# Altium project pca10056.PrjPCB (part 1 of 5)
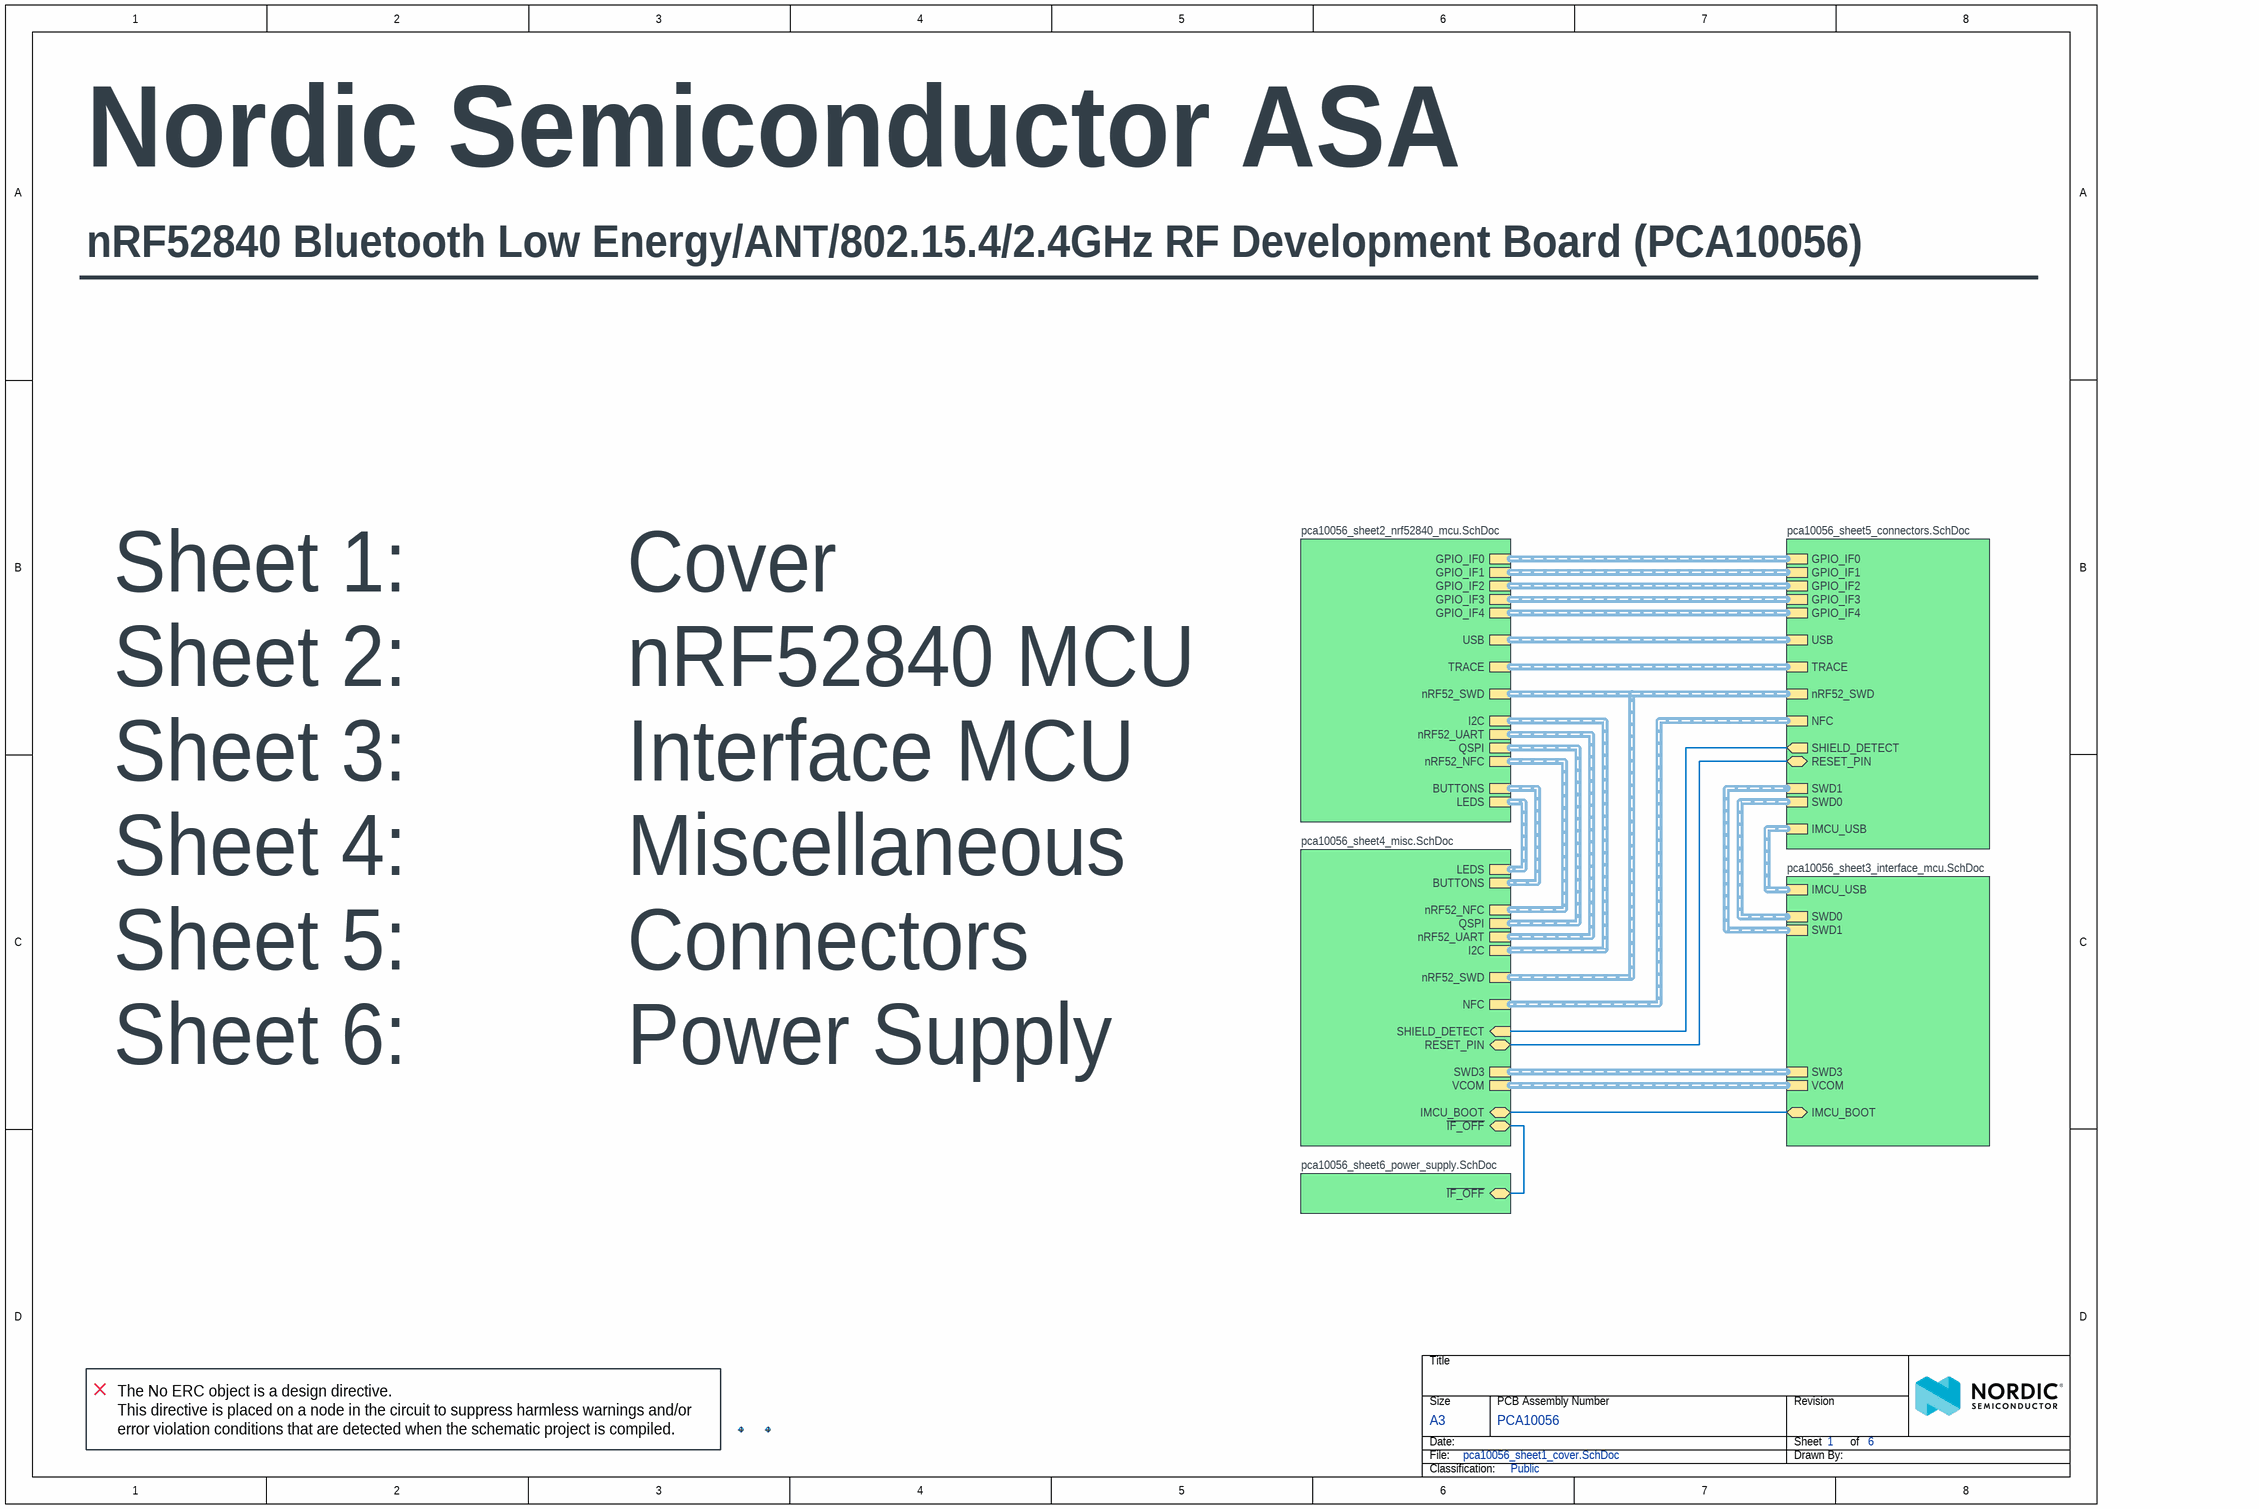
[diagram p0: pca10056_sheet1_cover.SchDoc]
SurfaceFinish: ENIG; SoldermaskColor: Blue; SilkscreenColor: White; ProjectNumber: 4440; ProjectName: nRF52840-DK; ProductName: nRF52840-DK; PCBStackup: 4001: Standard 1.6mm 1oz; PCBRevision: 0461RUBR; PCBNumber: 400236; PCARevision: 3.0.3; PCAName: PCA10056; Organization: Nordic Semiconductor; NrOfLayers: 4; Dielectric: FR-4 Halogen-Free; Designer: MASI/RUBR/STL1/RSK; Compliance: RoHS, REACH, Halogen-Free; Classification: Public; BoardTitle: nRF52840 Development Board; BoardThickness: 1.6mm
6 sheets, 344 parts. Net scope: hierarchical (ports join the sheet entries above them; power ports are global).
Board file: 400236.PcbDoc
Sheets:
  pca10056_sheet1_cover.SchDoc
     = pca10056_sheet2_nrf52840_mcu.SchDoc
     = pca10056_sheet3_interface_mcu.SchDoc
     = pca10056_sheet4_misc.SchDoc
     = pca10056_sheet5_connectors.SchDoc
     = pca10056_sheet6_power_supply.SchDoc

## Sheet pca10056_sheet1_cover.SchDoc: =BoardTitle + ' - Cover'
size A3; Organization: Nordic Semiconductor; DocumentNumber: 1; Revision: 3.0.3; SheetNumber: 1; SheetTotal: 6; Author: MASI/RUBR/STL1/RSK; CompanyName: Nordic Semiconductor; DrawnBy: MASI/RUBR/STL1/RSK; DocumentSize: A3; ProjectName: nRF52840-DK

### Parts
Fid1  Fiducial mark  [Fiducial]  (value not drawn)
Fid2  Fiducial mark  [Fiducial]  (value not drawn)

### Sub-sheets
? = pca10056_sheet2_nrf52840_mcu.SchDoc: nRF52_SWD (harness SWD), BUTTONS (harness BUTTONS), GPIO_IF2 (harness GPIO_IF2), GPIO_IF4 (harness GPIO_IF4), I2C (harness I2C), nRF52_UART (harness nRF52_UART), GPIO_IF1 (harness GPIO_IF1), GPIO_IF0 (harness GPIO_IF0), QSPI (harness QSPI), TRACE (harness TRACE), nRF52_NFC (harness NFC), LEDS (harness LED), USB (harness USB), GPIO_IF3 (harness GPIO_IF3)
? = pca10056_sheet3_interface_mcu.SchDoc: SWD0 (harness SWD), IMCU_BOOT (bidir), SWD3 (harness SWD), SWD1 (harness SWD), VCOM (harness UART), IMCU_USB (harness USB)
? = pca10056_sheet4_misc.SchDoc: NFC (harness NFC), QSPI (harness QSPI), SHIELD_DETECT (in), LEDS (harness LED), SWD3 (harness SWD), nRF52_UART (harness nRF52_UART), ~{IF_OFF} (bidir), nRF52_NFC (harness NFC), I2C (harness I2C), BUTTONS (harness BUTTONS), IMCU_BOOT (bidir), RESET_PIN (bidir), nRF52_SWD (harness SWD), VCOM (harness UART)
? = pca10056_sheet5_connectors.SchDoc: SWD0 (harness SWD), SHIELD_DETECT (out), SWD1 (harness SWD), RESET_PIN (bidir), GPIO_IF2 (harness GPIO_IF2), USB (harness USB), GPIO_IF4 (harness GPIO_IF4), nRF52_SWD (harness SWD), GPIO_IF3 (harness GPIO_IF3), TRACE (harness TRACE), GPIO_IF1 (harness GPIO_IF1), GPIO_IF0 (harness GPIO_IF0), IMCU_USB (harness USB), NFC (harness NFC)
? = pca10056_sheet6_power_supply.SchDoc: ~{IF_OFF} (bidir)

### Nets
~{IF_OFF}: sheet /~{IF_OFF}, sheet /~{IF_OFF}
IMCU_BOOT: sheet /IMCU_BOOT, sheet /IMCU_BOOT
RESET_PIN: sheet /RESET_PIN, sheet /RESET_PIN
NetR68_1: sheet /SHIELD_DETECT, sheet /SHIELD_DETECT

### Notes on the sheet
- Nordic Semiconductor ASA
- ________________________________________________________________
- nRF52840 Bluetooth Low Energy/ANT/802.15.4/2.4GHz RF Development Board (PCA10056)
- Sheet 1:          Cover
- Sheet 2:          nRF52840 MCU
- Sheet 3:          Interface MCU
- Sheet 4:          Miscellaneous
- Sheet 5:          Connectors
- Sheet 6:          Power Supply
- (near Fid1) The No ERC object is a design directive.
  This directive is placed on a node in the circuit to suppress harmless warnings and/or error violation conditions that are detected when the schematic project is compiled.
- Title
- Size
- Date:
- File:
- A3
- PCB Assembly Number
- Sheet         of
- Drawn By:
- Revision
- Classification:

### Library data of the parts
Fid1 Fid2 = Fid-Mark: Manufacturer: N.A.; Part number NEMS: 100500073; Value: N.A.; Pad Count: 1; Component Status: Active; System: Connector; Part Number: Fid-Mark; Manufacturer Part Number: N.A.; LatestRevisionDate: 2009-12-12; Published: 2009-12-12; Note: N.A.; Artikkelnr Noca: N.A.; Footprint Doc: Fiducial; Part number IPS: N.A.; ComponentLink1URL: N.A.; ComponentLink1Description: Datasheet; ComponentLink2URL: N.A.; ComponentLink2Description: Supplier link; HelpURL: N.A.; Supplier 1: N.A.; Supplier Part Number 1: N.A.; Supplier 2: N.A.; Supplier Part Number 2: N.A.; Author: rsk; Component Class: Connectors; PartId: 100500073; Part number Norautron: N.A.

## Sheet pca10056_sheet2_nrf52840_mcu.SchDoc: =BoardTitle + ' - nRF52840 MCU'
size A3; Organization: Nordic Semiconductor; DocumentNumber: 2; Revision: 3.0.3; SheetNumber: 2; SheetTotal: 6; Author: MASI/RUBR/STL1/RSK; CompanyName: Nordic Semiconductor; DrawnBy: MASI/RUBR/STL1/RSK; DocumentSize: A3; ProjectName: nRF52840-DK
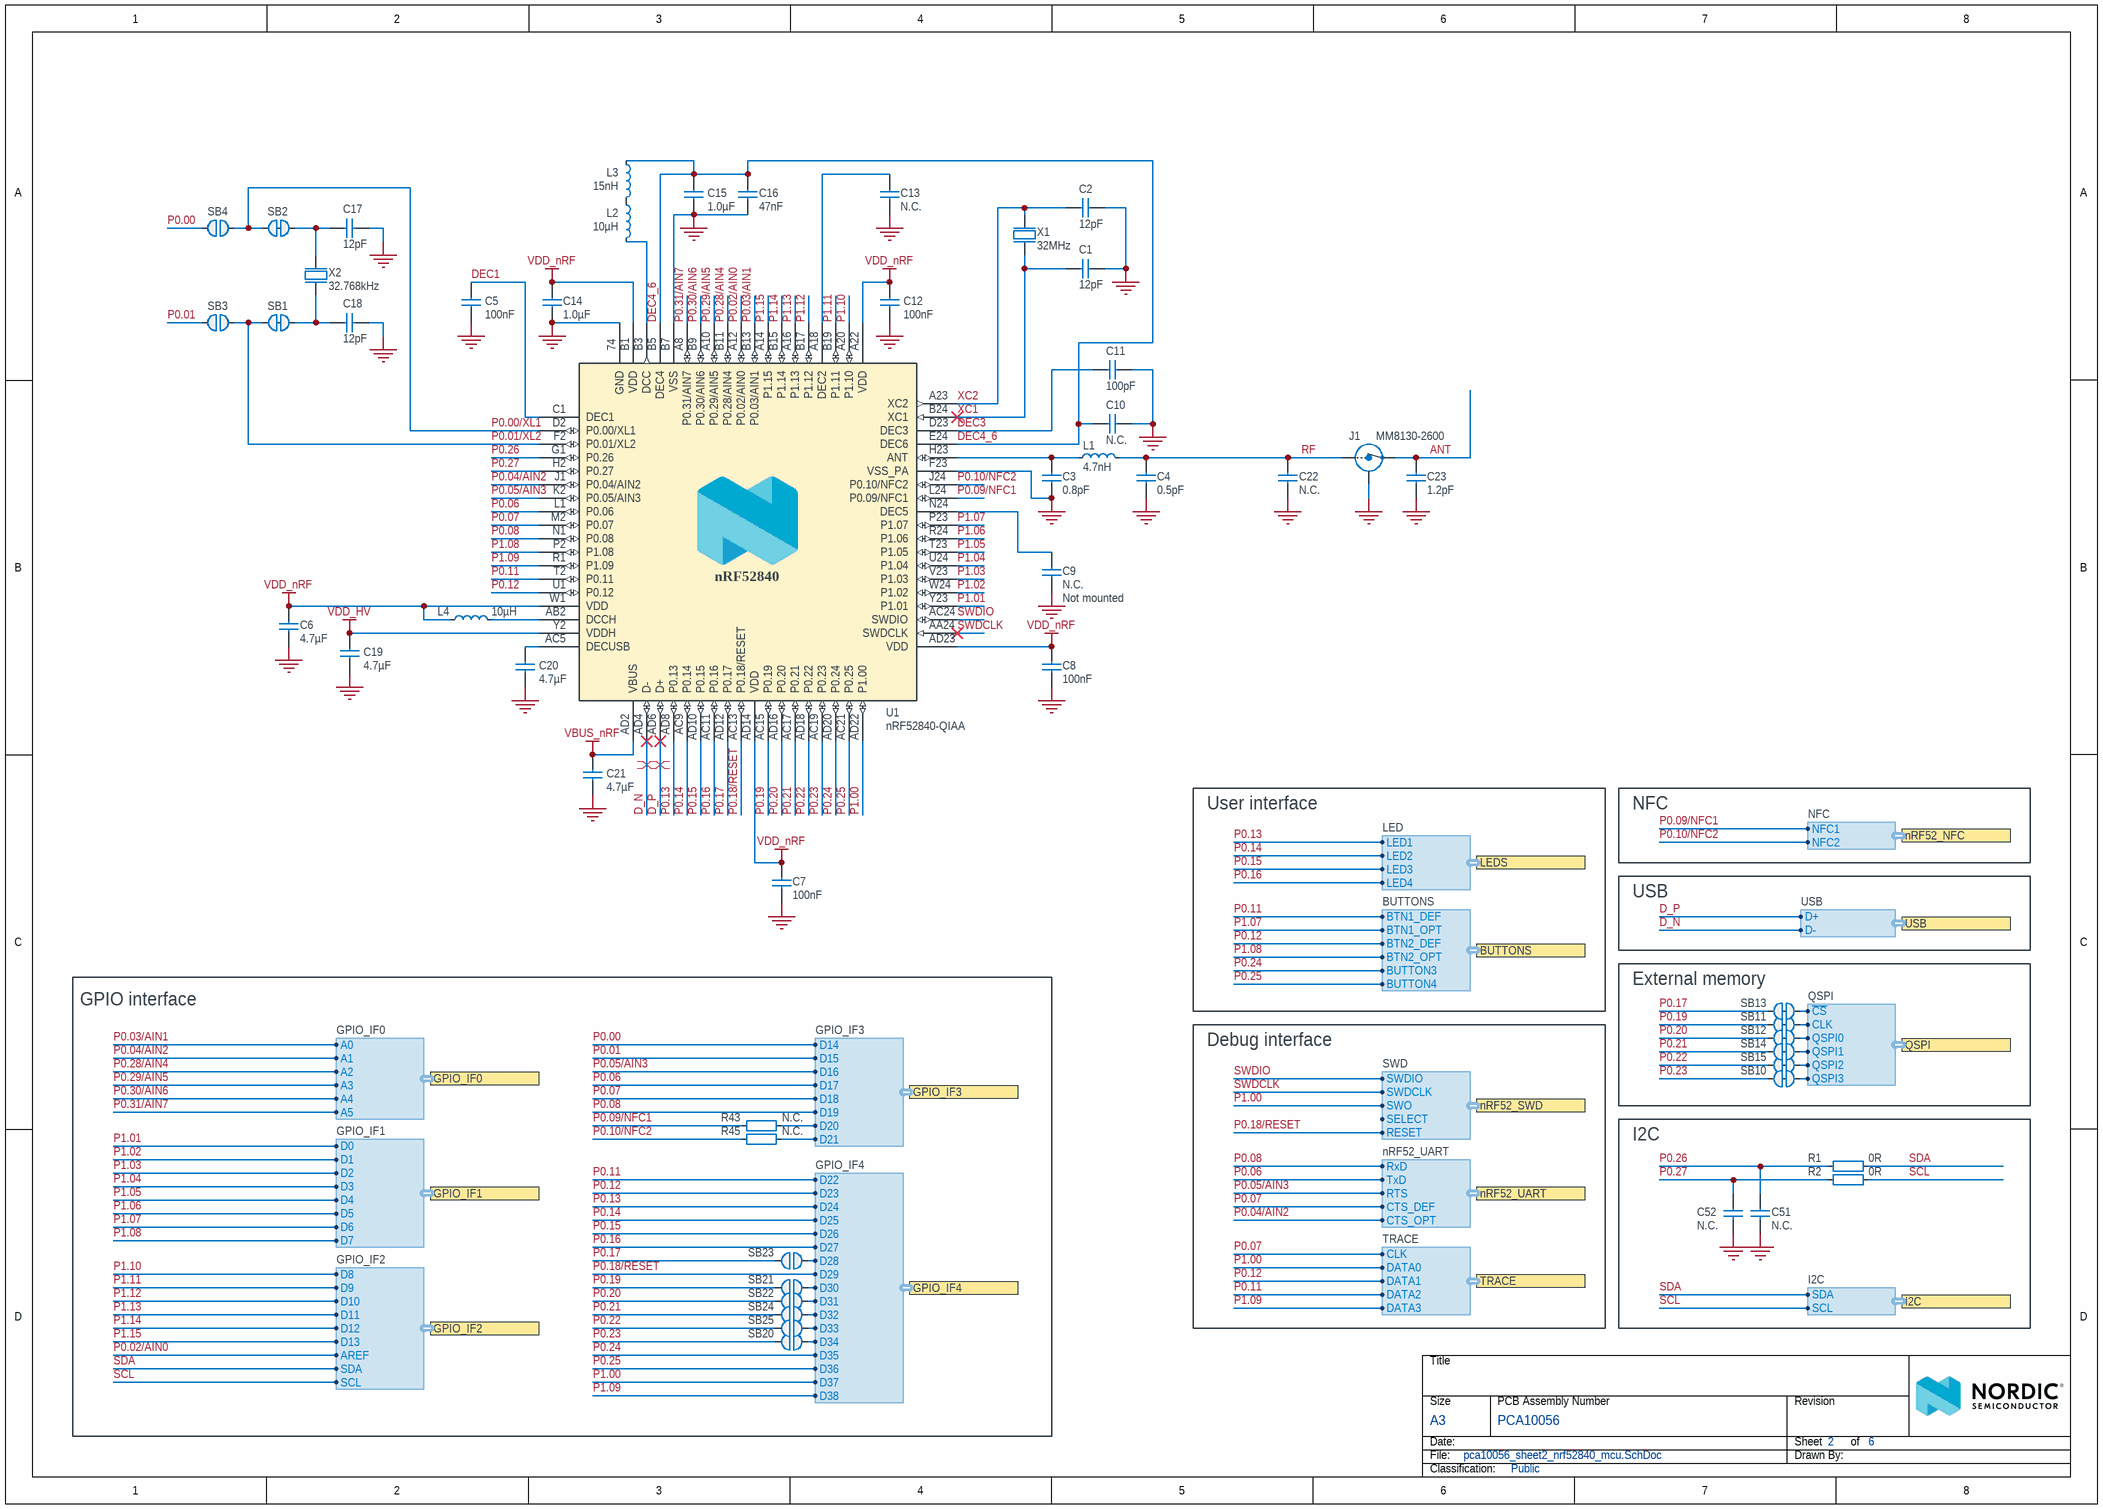
[diagram p1: pca10056_sheet2_nrf52840_mcu.SchDoc]

### Parts
C1  12pF  [CAPC1005X04L]
C2  12pF  [CAPC1005X04L]
C3  0.8pF  [CAPC1005X04L]
C4  0.5pF  [CAPC1005X04L]
C5  100nF  [CAPC1005X04L]
C6  4.7µF  [CAPC1608X06L]
C7  100nF  [CAPC1005X04L]
C8  100nF  [CAPC1005X04L]
C9  N.C.  Assembly: Not mounted  [CAPC1005X04L_NC]
C10  N.C.  [CAPC1005X04L_NC]
C11  100pF  [CAPC1005X04L]
C12  100nF  [CAPC1005X04L]
C13  N.C.  [CAPC1005X04L_NC]
C14  1.0µF  [CAPC1608X06L]
C15  1.0µF  [CAPC1608X06L]
C16  47nF  [CAPC1005X04L]
C17  12pF  [CAPC1005X04L]
C18  12pF  [CAPC1005X04L]
C19  4.7µF  [CAPC1608X06L]
C20  4.7µF  [CAPC1608X06L]
C21  4.7µF  [CAPC1608X06L]
C22  N.C.  [CAPC1005X04L_NC]
C23  1.2pF  [CAPC1005X04L]
C51  N.C.  [CAPC0603X03L_C_NC]
C52  N.C.  [CAPC0603X03L_C_NC]
J1  MM8130-2600  [COAXIAL-SWF]
L1  4.7nH  [INDC1005X04L]
L2  10µH  [INDC1608X06L]
L3  15nH  [INDC1005X04L]
L4  10µH  [INDC1608X06L]
R1  0R  [RESC0603X03L_C]
R2  0R  [RESC0603X03L_C]
R43  N.C.  [RESC1005X04L_NC]
R45  N.C.  [RESC1005X04L_NC]
SB1  Solderbridge  [Solderbridge_Shorted]  (value not drawn)  (net tie, no BOM)
SB2  Solderbridge  [Solderbridge_Shorted]  (value not drawn)  (net tie, no BOM)
SB3  Solderbridge  [Solderbridge]  (value not drawn)  (no BOM)
SB4  Solderbridge  [Solderbridge]  (value not drawn)  (no BOM)
SB10  Solderbridge  [Solderbridge_Shorted]  (value not drawn)  (net tie, no BOM)
SB11  Solderbridge  [Solderbridge_Shorted]  (value not drawn)  (net tie, no BOM)
SB12  Solderbridge  [Solderbridge_Shorted]  (value not drawn)  (net tie, no BOM)
SB13  Solderbridge  [Solderbridge_Shorted]  (value not drawn)  (net tie, no BOM)
SB14  Solderbridge  [Solderbridge_Shorted]  (value not drawn)  (net tie, no BOM)
SB15  Solderbridge  [Solderbridge_Shorted]  (value not drawn)  (net tie, no BOM)
SB20  Solderbridge  [Solderbridge]  (value not drawn)  (no BOM)
SB21  Solderbridge  [Solderbridge]  (value not drawn)  (no BOM)
SB22  Solderbridge  [Solderbridge]  (value not drawn)  (no BOM)
SB23  Solderbridge  [Solderbridge]  (value not drawn)  (no BOM)
SB24  Solderbridge  [Solderbridge]  (value not drawn)  (no BOM)
SB25  Solderbridge  [Solderbridge]  (value not drawn)  (no BOM)
U1  nRF52840-QIAA  [AQFN50P700X700X85_HS-74N]
X1  32MHz  [BT-XTAL_2016]
X2  32.768kHz  [XTAL_3215]

### Blocks framed on the sheet
GPIO interface: R43 R45 SB20-SB25
External memory: SB10-SB15
I2C: C51 C52 R1 R2

### Ports
BUTTONS (harness BUTTONS), GPIO_IF0 (harness GPIO_IF0), GPIO_IF1 (harness GPIO_IF1), GPIO_IF2 (harness GPIO_IF2), GPIO_IF3 (harness GPIO_IF3), GPIO_IF4 (harness GPIO_IF4), I2C (harness I2C), LEDS (harness LED), nRF52_NFC (harness NFC), nRF52_SWD (harness SWD), nRF52_UART (harness nRF52_UART), QSPI (harness QSPI), TRACE (harness TRACE), USB (harness USB)

### Harnesses
BUTTONS: BTN2_OPT, BTN2_DEF, BTN1_OPT, BTN1_DEF, BUTTON3, BUTTON4
QSPI: ~{CS}, QSPI0, CLK, QSPI1, QSPI2, QSPI3
SWD: SWDIO, SWDCLK, SWO, RESET, SELECT
LED: LED4, LED3, LED2, LED1
USB: D+, D-
TRACE: CLK, DATA0, DATA1, DATA3, DATA2
NFC: NFC2, NFC1
GPIO_IF1: D0, D1, D2, D3, D4, D5, D6, D7
GPIO_IF2: D8, D9, D10, D11, D12, D13, AREF, SDA, SCL
GPIO_IF0: A0, A1, A2, A3, A4, A5
GPIO_IF3: D14, D15, D16, D17, D18, D19, D20, D21
I2C: SCL, SDA
GPIO_IF4: D22, D23, D24, D25, D26, D27, D28, D29, D30, D31, D32, D33, D34, D35, D36, D37, D38
nRF52_UART: RTS, CTS_DEF, CTS_OPT, TxD, RxD

### Nets
GND: C1.2 C2.2 C3.1 C4.1 C5.2 C6.2 C7.2 C8.2 C9.2 C10.1 C11.2 C12.2 C13.2 C14.2 C15.1 C16.2 C17.1 C18.1 C19.2 C20.2 C21.2 C22.2 C23.2 C51.1 C52.1 J1.2(Shield) U1.74(GND) U1.B7(VSS) U1.F23(VSS_PA) X1.2(GND) X1.4(GND)
VBUS_nRF: C21.1 U1.AD2(VBUS)
VDD_HV: C19.1 U1.Y2(VDDH)
VDD_nRF: C6.1 C7.1 C8.1 C12.1 C14.1 L4.1 U1.A22(VDD) U1.AD14(VDD) U1.AD23(VDD) U1.B1(VDD) U1.W1(VDD)
ANT: C23.1 J1.3(OUT)
D_N: U1.AD4(D-) ; port USB.D-
D_P: U1.AD6(D+) ; port USB.D+
DEC1: C5.1 U1.C1(DEC1)
DEC3: C11.1 U1.D23(DEC3)
DEC4_6: C10.2 C15.2 C16.1 L3.1 U1.B5(DEC4) U1.E24(DEC6)
P0.00: SB4.2 ; port GPIO_IF3.D14
P0.00/XL1: SB2.2 SB4.1 U1.D2(P0.00/XL1)
P0.01: SB3.2 ; port GPIO_IF3.D15
P0.01/XL2: SB1.2 SB3.1 U1.F2(P0.01/XL2)
P0.02/AIN0: U1.A12(P0.02/AIN0) ; port GPIO_IF2.AREF
P0.03/AIN1: U1.B13(P0.03/AIN1) ; port GPIO_IF0.A0
P0.04/AIN2: U1.J1(P0.04/AIN2) ; port GPIO_IF0.A1, port nRF52_UART.CTS_OPT
P0.05/AIN3: U1.K2(P0.05/AIN3) ; port GPIO_IF3.D16, port nRF52_UART.RTS
P0.06: U1.L1(P0.06) ; port GPIO_IF3.D17, port nRF52_UART.TxD
P0.07: U1.M2(P0.07) ; port TRACE.CLK, port GPIO_IF3.D18, port nRF52_UART.CTS_DEF
P0.08: U1.N1(P0.08) ; port GPIO_IF3.D19, port nRF52_UART.RxD
P0.09/NFC1: R43.2 U1.L24(P0.09/NFC1) ; port nRF52_NFC.NFC1
P0.10/NFC2: R45.2 U1.J24(P0.10/NFC2) ; port nRF52_NFC.NFC2
P0.11: U1.T2(P0.11) ; port BUTTONS.BTN1_DEF, port TRACE.DATA2, port GPIO_IF4.D22
P0.12: U1.U1(P0.12) ; port BUTTONS.BTN2_DEF, port TRACE.DATA1, port GPIO_IF4.D23
P0.13: U1.AD8(P0.13) ; port LEDS.LED1, port GPIO_IF4.D24
P0.14: U1.AC9(P0.14) ; port LEDS.LED2, port GPIO_IF4.D25
P0.15: U1.AD10(P0.15) ; port LEDS.LED3, port GPIO_IF4.D26
P0.16: U1.AC11(P0.16) ; port LEDS.LED4, port GPIO_IF4.D27
P0.17: SB13.1 SB23.1 U1.AD12(P0.17)
P0.18/RESET: U1.AC13(P0.18/RESET) ; port nRF52_SWD.RESET, port GPIO_IF4.D29
P0.19: SB11.1 SB21.1 U1.AC15(P0.19)
P0.20: SB12.1 SB22.1 U1.AD16(P0.20)
P0.21: SB14.1 SB24.1 U1.AC17(P0.21)
P0.22: SB15.1 SB25.1 U1.AD18(P0.22)
P0.23: SB10.1 SB20.1 U1.AC19(P0.23)
P0.24: U1.AD20(P0.24) ; port BUTTONS.BUTTON3, port GPIO_IF4.D35
P0.25: U1.AC21(P0.25) ; port BUTTONS.BUTTON4, port GPIO_IF4.D36
P0.26: C51.2 R1.2 U1.G1(P0.26)
P0.27: C52.2 R2.2 U1.H2(P0.27)
P0.28/AIN4: U1.B11(P0.28/AIN4) ; port GPIO_IF0.A2
P0.29/AIN5: U1.A10(P0.29/AIN5) ; port GPIO_IF0.A3
P0.30/AIN6: U1.B9(P0.30/AIN6) ; port GPIO_IF0.A4
P0.31/AIN7: U1.A8(P0.31/AIN7) ; port GPIO_IF0.A5
P1.00: U1.AD22(P1.00) ; port nRF52_SWD.SWO, port TRACE.DATA0, port GPIO_IF4.D37
P1.01: U1.Y23(P1.01) ; port GPIO_IF1.D0
P1.02: U1.W24(P1.02) ; port GPIO_IF1.D1
P1.03: U1.V23(P1.03) ; port GPIO_IF1.D2
P1.04: U1.U24(P1.04) ; port GPIO_IF1.D3
P1.05: U1.T23(P1.05) ; port GPIO_IF1.D4
P1.06: U1.R24(P1.06) ; port GPIO_IF1.D5
P1.07: U1.P23(P1.07) ; port BUTTONS.BTN1_OPT, port GPIO_IF1.D6
P1.08: U1.P2(P1.08) ; port BUTTONS.BTN2_OPT, port GPIO_IF1.D7
P1.09: U1.R1(P1.09) ; port TRACE.DATA3, port GPIO_IF4.D38
P1.10: U1.A20(P1.10) ; port GPIO_IF2.D8
P1.11: U1.B19(P1.11) ; port GPIO_IF2.D9
P1.12: U1.B17(P1.12) ; port GPIO_IF2.D10
P1.13: U1.A16(P1.13) ; port GPIO_IF2.D11
P1.14: U1.B15(P1.14) ; port GPIO_IF2.D12
P1.15: U1.A14(P1.15) ; port GPIO_IF2.D13
RF: C4.2 C22.1 J1.1(IN) L1.2
SCL: R2.1 ; port GPIO_IF2.SCL, port I2C.SCL
SDA: R1.1 ; port GPIO_IF2.SDA, port I2C.SDA
SWDCLK: U1.AA24(SWDCLK) ; port nRF52_SWD.SWDCLK
SWDIO: U1.AC24(SWDIO) ; port nRF52_SWD.SWDIO
XC1: C1.1 U1.B24(XC1) X1.1(inp)
XC2: C2.1 U1.A23(XC2) X1.3(out)
NetC3_2: C3.2 L1.1 U1.H23(ANT)
NetC9_1: C9.1 U1.N24(DEC5)
NetC13_1: C13.1 U1.A18(DEC2)
NetC17_2: C17.2 SB2.1 X2.1(inp)
NetC18_2: C18.2 SB1.1 X2.2(out)
NetC20_1: C20.1 U1.AC5(DECUSB)
NetL2_1: L2.1 L3.2
NetL2_2: L2.2 U1.B3(DCC)
NetL4_2: L4.2 U1.AB2(DCCH)
NetP6_7: R43.1 ; port GPIO_IF3.D20
NetP6_8: R45.1 ; port GPIO_IF3.D21
NetP24_7: SB23.2 ; port GPIO_IF4.D28
NetP24_9: SB21.2 ; port GPIO_IF4.D30
NetP24_10: SB22.2 ; port GPIO_IF4.D31
NetP24_11: SB24.2 ; port GPIO_IF4.D32
NetP24_12: SB25.2 ; port GPIO_IF4.D33
NetP24_13: SB20.2 ; port GPIO_IF4.D34
NetSB10_2: SB10.2 ; port QSPI.QSPI3
NetSB11_2: SB11.2 ; port QSPI.CLK
NetSB12_2: SB12.2 ; port QSPI.QSPI0
NetSB13_2: SB13.2 ; port QSPI.~{CS}
NetSB14_2: SB14.2 ; port QSPI.QSPI1
NetSB15_2: SB15.2 ; port QSPI.QSPI2

### Layout directives
differential pair: D_N, D_P

### Notes on the sheet
- User interface
- NFC
- USB
- Debug interface
- Title
- Size
- Date:
- File:
- A3
- PCB Assembly Number
- Sheet         of
- Drawn By:
- Revision
- Classification:
- (in symbol nRF52840-QIAAF0) nRF52840

### Library data of the parts
C1 C2 C17 C18 = C0402-12p: Capacitor, NP0, ±2%; Manufacturer: N.A.; Part number IPS: 00000002398; Part number NEMS: 100200137; Note: 50V; Artikkelnr Noca: 20029159; Pad Count: 2; Component Status: Active; Part Number: C0402-12p; LatestRevisionDate: 2011-05-11; Published: 2009-05-08; Value: 12pF; Footprint Doc: 0402; Manufacturer Part Number: N.A.; ComponentLink1URL: N.A.; ComponentLink1Description: Datasheet; ComponentLink2URL: N.A.; ComponentLink2Description: Supplier link; HelpURL: N.A.; Supplier 1: N.A.; Supplier Part Number 1: N.A.; Supplier 2: N.A.; Supplier Part Number 2: N.A.; Author: rsk; Component Class: Capacitors; PartId: 100200137; Part number Norautron: N.A.
C3 = C0402-0.8p: Capacitor, NP0, ±5%; Manufacturer: N.A.; Part number IPS: 00000007782; Part number NEMS: 100200116; Note: 50V; Pad Count: 2; Component Status: Active; Part Number: C0402-0.8p; LatestRevisionDate: 2012-11-21; Published: 2009-05-08; Value: 0.8pF; Footprint Doc: 0402; Manufacturer Part Number: N.A.; Artikkelnr Noca: N.A.; ComponentLink1URL: https://www.murata.com/~/media/webrenewal/support/library/catalog/products/capacitor/mlcc/c02e.ashx?la=en-us; ComponentLink1Description: Datasheet; ComponentLink2URL: N.A.; ComponentLink2Description: Supplier link; HelpURL: N.A.; Supplier 1: N.A.; Supplier Part Number 1: N.A.; Supplier 2: N.A.; Supplier Part Number 2: N.A.; Author: rsk; Component Class: Capacitors; PartId: 100200116; Part number Norautron: N.A.
C4 = C0402-0.5p: Capacitor, C0G, ±0.05pF, 50V; Manufacturer: N.A.; Part number IPS: 00000004293; Part number NEMS: 100200112; Pad Count: 2; Component Status: Active; Part Number: C0402-0.5p; LatestRevisionDate: 2020-10-13; Published: 2009-05-08; Value: 0.5pF; Note: 50V; Footprint Doc: 0402; Manufacturer Part Number: N.A.; Artikkelnr Noca: N.A.; ComponentLink1URL: N.A.; ComponentLink1Description: Datasheet; ComponentLink2URL: N.A.; ComponentLink2Description: Supplier link; HelpURL: N.A.; Supplier 1: N.A.; Supplier Part Number 1: N.A.; Supplier 2: N.A.; Supplier Part Number 2: N.A.; Author: rsk; Component Class: Capacitors; PartId: 100200112; Part number Norautron: N.A.
C5 C7 C8 C12 = C0402-100n: Capacitor, X7R, ±10%; Manufacturer: N.A.; Part number IPS: 00000005296; Part number NEMS: 100200184; Note: 16V; Artikkelnr Noca: 20039200; Pad Count: 2; Component Status: Active; Part Number: C0402-100n; LatestRevisionDate: 2009-11-23; Published: 2009-05-08; Value: 100nF; Footprint Doc: 0402; Manufacturer Part Number: N.A.; ComponentLink1URL: N.A.; ComponentLink1Description: Datasheet; ComponentLink2URL: N.A.; ComponentLink2Description: Supplier link; HelpURL: N.A.; Supplier 1: N.A.; Supplier Part Number 1: N.A.; Supplier 2: N.A.; Supplier Part Number 2: N.A.; Author: rsk; Component Class: Capacitors; PartId: 100200184; Part number Norautron: N.A.
C6 C20 = C0603-4µ7-6.3V-X7R: Capacitor, X7R, ±10%, 6.3V; Manufacturer: Samsung Electro-Mechanics America; Manufacturer Part Number: CL10B475KQ8NQNC; Part number IPS: 00000002541; Part number Norautron: N.A.; Part number NEMS: 100200350; Artikkelnr Noca: 20039473; Pad Count: 2; Component Status: Active; Part Number: C0603-4µ7-6.3V-X7R; LatestRevisionDate: 2015-06-10; Published: 2015-06-10; Value: 4.7µF; Note: 6.3V; Footprint Doc: 0603; ComponentLink1URL: N.A.; ComponentLink1Description: Datasheet; ComponentLink2URL: N.A.; ComponentLink2Description: Supplier link; HelpURL: http://media.digikey.com/pdf/Data%20Sheets/Samsung%20PDFs/CL10B475KQ8NQNC_Spec.pdf; Supplier 1: Digi-Key; Supplier Part Number 1: 1276-2087-1-ND; Supplier 2: N.A.; Supplier Part Number 2: N.A.; Author: rsk; Component Class: Capacitors; PartId: 100200350
C9 = C0402-N.C.: Not mounted; Manufacturer: N.A.; Part number NEMS: 100200105; Note: Chip Cap; Pad Count: 2; Component Status: Active; Part Number: C0402-N.C.; LatestRevisionDate: 2009-05-08; Published: 2009-05-08; Value: N.C.; Footprint Doc: 0402; Manufacturer Part Number: N.A.; Artikkelnr Noca: N.A.; Part number IPS: N.A.; ComponentLink1URL: N.A.; ComponentLink1Description: Datasheet; ComponentLink2URL: N.A.; ComponentLink2Description: Supplier link; HelpURL: N.A.; Supplier 1: N.A.; Supplier Part Number 1: N.A.; Supplier 2: N.A.; Supplier Part Number 2: N.A.; PartId: 100200105; Component Class: Capacitors; Author: rsk; Part number Norautron: N.A.
C10 C13 C22 = C0402-N.C.: Not mounted; Manufacturer: N.A.; Part number NEMS: 100200105; Note: Chip Cap; Assembly: Not mounted; Pad Count: 2; Component Status: Active; Part Number: C0402-N.C.; LatestRevisionDate: 2009-05-08; Published: 2009-05-08; Value: N.C.; Footprint Doc: 0402; Manufacturer Part Number: N.A.; Artikkelnr Noca: N.A.; Part number IPS: N.A.; ComponentLink1URL: N.A.; ComponentLink1Description: Datasheet; ComponentLink2URL: N.A.; ComponentLink2Description: Supplier link; HelpURL: N.A.; Supplier 1: N.A.; Supplier Part Number 1: N.A.; Supplier 2: N.A.; Supplier Part Number 2: N.A.; Author: rsk; Component Class: Capacitors; PartId: 100200105; Part number Norautron: N.A.
C11 = C0402-100p: Capacitor, NP0, ±5%; Manufacturer: N.A.; Part number IPS: 00000002361; Part number NEMS: 100200148; Note: 50V; Artikkelnr Noca: 20029135; Pad Count: 2; Component Status: Active; Part Number: C0402-100p; LatestRevisionDate: 2009-05-08; Published: 2009-05-08; Value: 100pF; Footprint Doc: 0402; Manufacturer Part Number: N.A.; ComponentLink1URL: N.A.; ComponentLink1Description: Datasheet; ComponentLink2URL: N.A.; ComponentLink2Description: Supplier link; HelpURL: N.A.; Supplier 1: N.A.; Supplier Part Number 1: N.A.; Supplier 2: N.A.; Supplier Part Number 2: N.A.; Author: rsk; Component Class: Capacitors; PartId: 100200148; Part number Norautron: N.A.
C14 C15 = C0603-1µ0: Capacitor, X7R, ±10%; Manufacturer: N.A.; Part number IPS: 00000000616; Part number Norautron: 262083409; Part number NEMS: 100200271; Note: 16V; Artikkelnr Noca: 20039282; Pad Count: 2; Component Status: Active; Part Number: C0603-1µ0; LatestRevisionDate: 2013-06-05; Published: 2009-05-08; Value: 1.0µF; Footprint Doc: 0603; Manufacturer Part Number: N.A.; ComponentLink1URL: N.A.; ComponentLink1Description: Datasheet; ComponentLink2URL: N.A.; ComponentLink2Description: Supplier link; HelpURL: N.A.; Supplier 1: N.A.; Supplier Part Number 1: N.A.; Supplier 2: N.A.; Supplier Part Number 2: N.A.; Author: rsk; Component Class: Capacitors; PartId: 100200271
C16 = C0402-47n: Capacitor, X7R, ±10%, 25V; Manufacturer: N.A.; Part number IPS: 00000003143; Part number NEMS: 100200180; Note: Chip Cap 10%; Artikkelnr Noca: 20039389; Pad Count: 2; Component Status: Active; Part Number: C0402-47n; LatestRevisionDate: 2020-10-13; Published: 2009-05-08; Value: 47nF; Footprint Doc: 0402; Manufacturer Part Number: N.A.; ComponentLink1URL: N.A.; ComponentLink1Description: Datasheet; ComponentLink2URL: N.A.; ComponentLink2Description: Supplier link; HelpURL: N.A.; Supplier 1: N.A.; Supplier Part Number 1: N.A.; Supplier 2: N.A.; Supplier Part Number 2: N.A.; Author: rsk; Component Class: Capacitors; PartId: 100200180; Part number Norautron: N.A.
C19 C21 = C0603-4µ7-10V-X7S: Capacitor, X7S, ±10%, 10V; Manufacturer: N.A.; Part number IPS: 00000001779; Part number NEMS: 100200351; Artikkelnr Noca: 20030013; Pad Count: 2; Component Status: Active; Part Number: C0603-4µ7-10V-X7S; LatestRevisionDate: 2016-08-15; Published: 2016-08-15; Value: 4.7µF; Note: 10V; Footprint Doc: 0603; Manufacturer Part Number: N.A.; ComponentLink1URL: N.A.; ComponentLink1Description: Datasheet; ComponentLink2URL: N.A.; ComponentLink2Description: Supplier link; HelpURL: N.A.; Supplier 1: Digi-Key; Supplier Part Number 1: 445-14258-1-ND; Supplier 2: N.A.; Supplier Part Number 2: N.A.; Author: rsk; Component Class: Capacitors; PartId: 100200351; Part number Norautron: N.A.
C23 = C0402-1.2p: Capacitor, NP0, ±0.1pF; Manufacturer: N.A.; Part number IPS: 00000005410; Part number NEMS: 100200119; Note: 50V; Artikkelnr Noca: 20029157; Pad Count: 2; Component Status: Active; Part Number: C0402-1.2p; Manufacturer Part Number: N.A.; LatestRevisionDate: 2011-05-11; Published: 2009-05-08; Value: 1.2pF; Footprint Doc: 0402; ComponentLink1URL: N.A.; ComponentLink1Description: Datasheet; ComponentLink2URL: N.A.; ComponentLink2Description: Supplier link; HelpURL: N.A.; Supplier 1: N.A.; Supplier Part Number 1: N.A.; Supplier 2: N.A.; Supplier Part Number 2: N.A.; Author: rsk; Component Class: Capacitors; PartId: 100200119; Part number Norautron: N.A.
C51 C52 = C0201-N.C.: Not mounted; Manufacturer: N.A.; Part number NEMS: 100200001; Assembly: Not mounted; Note: Chip Cap; Pad Count: 2; Component Status: Active; Part Number: C0201-N.C.; Manufacturer Part Number: N.A.; Footprint Doc: 0201; LatestRevisionDate: 2014-11-13; Published: 2014-11-13; Value: N.C.; Artikkelnr Noca: N.A.; Part number IPS: N.A.; ComponentLink1URL: N.A.; ComponentLink1Description: Datasheet; ComponentLink2URL: N.A.; ComponentLink2Description: Supplier link; HelpURL: N.A.; Supplier 1: N.A.; Supplier Part Number 1: N.A.; Supplier 2: N.A.; Supplier Part Number 2: N.A.; Component Class: Capacitors; PartId: 100200001; Author: rsk; Part number Norautron: N.A.
J1 = MM8130-2600: Coaxial Connector with Switch; Manufacturer: Murata; Part number IPS: 00000009955; Part number Norautron: 26030338; Part number NEMS: 100500400; Note: N.A.; Artikkelnr Noca: 55029011; Pad Count: 3; Component Status: Active; Part Number: MM8130-2600; Manufacturer Part Number: MM8130-2600; LatestRevisionDate: 2014-04-24; Published: 2014-04-24; Value: MM8130-2600; Footprint Doc: COAXIAL-SWF; ComponentLink1URL: N.A.; ComponentLink1Description: Datasheet; ComponentLink2URL: N.A.; ComponentLink2Description: Supplier link; HelpURL: http://www.murata.com/products/catalog/pdf/o33e.pdf; Supplier 1: Digi-Key; Supplier Part Number 1: 490-4981-1-ND; Supplier 2: Mouser; Supplier Part Number 2: 81-MM8130-2600RA2; Author: rsk; Component Class: Connectors; PartId: 100500400; System: Connector
L1 = L0402-4n7-LQG15HS4N7B02D: Inductor, 700mA, ±0.1nH, 160mR LQG; Manufacturer: Murata; Part number NEMS: 100300410; Pad Count: 2; Note: High frequency chip inductor ±5%; Artikkelnr Noca: N.A.; Component Status: Active; Part Number: L0402-4n7-LQG15HS4N7B02D; PartId: 100300410; Component Class: Inductors; Author: stl1; Manufacturer Part Number: LQG15HS4N7B02D; ComponentLink1URL: N.A.; ComponentLink1Description: Datasheet; ComponentLink2URL: N.A.; ComponentLink2Description: Supplier link; HelpURL: https://search.murata.co.jp/Ceramy/image/img/P02/JELF243B-0010.pdf; Footprint Doc: 0402; LatestRevisionDate: 2022-02-09; Published: 2022-02-09; Value: 4.7nH; Supplier 1: Digi-Key; Supplier Part Number 1: 490-LQG15HS4N7B02DTR-ND; Supplier 2: Mouser; Supplier Part Number 2: 81-LQG15HS4N7B02D; Part number IPS: N.A.; Part number Norautron: N.A.
L2 L4 = L0603-10µ-TDK: Inductor, 250mA, ±20%, 1.05ohm. -55°C ~ 125°C; Manufacturer: TDK Corporation; Manufacturer Part Number: MLZ1608M100WTD25; Part number Norautron: 26521771; Part number NEMS: 100300079; Note: N.A.; Pad Count: 2; Component Status: Active; Part Number: L0603-10µ-TDK; LatestRevisionDate: 2012-09-19; Published: 2019-05-06; Value: 10µH; Footprint Doc: 0603; ComponentLink1Description: Datasheet; ComponentLink2Description: Supplier link; Artikkelnr Noca: N.A.; Part number IPS: N.A.; ComponentLink1URL: N.A.; ComponentLink2URL: N.A.; HelpURL: https://product.tdk.com/info/en/catalog/datasheets/inductor_automotive_decoupling_mlz1608_en.pdf; Supplier 1: Digi-Key; Supplier Part Number 1: 445-175588-1-ND; Supplier 2: Mouser; Supplier Part Number 2: 810-MLZ1608M100WTD25; Author: rsk; Component Class: Inductors; PartId: 100300079
L3 = L0402-15n-LQG15HS15NJ02D: Inductor, 450mA, ±5%,  0.32ohm; Manufacturer: Murata; Part number NEMS: 100300412; Pad Count: 2; Note: High frequency chip inductor ±5%; Artikkelnr Noca: N.A.; Component Status: Active; Part Number: L0402-15n-LQG15HS15NJ02D; PartId: 100300412; Component Class: Inductors; Author: stl1; Manufacturer Part Number: LQG15HS15NJ02D; ComponentLink1URL: N.A.; ComponentLink1Description: Datasheet; ComponentLink2URL: N.A.; ComponentLink2Description: Supplier link; HelpURL: https://no.mouser.com/datasheet/2/281/1/JELF243B_0010-1699614.pdf; Footprint Doc: 0402; LatestRevisionDate: 2022-02-10; Published: 2022-02-10; Value: 15nH; Supplier 1: Digi-Key; Supplier Part Number 1: 490-2625-2-ND; Supplier 2: Mouser; Supplier Part Number 2: 81-LQG15HS15NJ02D; Part number IPS: N.A.; Part number Norautron: N.A.
R1 R2 = R0201-0R: Resistor, ±5%, 0.05W; Manufacturer: N.A.; Part number IPS: 00000003245; Part number NEMS: 100100001; Note: Chip Res 5%; Pad Count: 2; Component Status: Active; Part Number: R0201-0R; Manufacturer Part Number: N.A.; Footprint Doc: 0201; LatestRevisionDate: 2017-11-09; Published: 2014-11-13; Value: 0R; Artikkelnr Noca: N.A.; ComponentLink1URL: N.A.; ComponentLink1Description: Datasheet; ComponentLink2URL: N.A.; ComponentLink2Description: Supplier link; HelpURL: N.A.; Supplier 1: N.A.; Supplier Part Number 1: N.A.; Supplier 2: N.A.; Supplier Part Number 2: N.A.; Component Class: Resistors; PartId: 100100001; Author: rsk; Part number Norautron: N.A.
R43 R45 = R0402-N.C.: Not mounted; Manufacturer: N.A.; Part number NEMS: 100100281; Note: Chip Res; Assembly: Not mounted; Pad Count: 2; Component Status: Active; Part Number: R0402-N.C.; Manufacturer Part Number: N.A.; Footprint Doc: 0402; LatestRevisionDate: 2009-05-08; Published: 2009-05-08; Value: N.C.; Artikkelnr Noca: N.A.; Part number IPS: N.A.; ComponentLink1URL: N.A.; ComponentLink1Description: Datasheet; ComponentLink2URL: N.A.; ComponentLink2Description: Supplier link; HelpURL: N.A.; Supplier 1: N.A.; Supplier Part Number 1: N.A.; Supplier 2: N.A.; Supplier Part Number 2: N.A.; Author: rsk; Component Class: Resistors; PartId: 100100281; Part number Norautron: N.A.
SB1 SB2 SB10-SB15 = Solderbridge Shorted: Shorted Solderbridge; Manufacturer: N.A.; Part number NEMS: 100500459; Pad Count: 2; Component Status: Active; System: Connector; Part Number: Solderbridge Shorted; Manufacturer Part Number: N.A.; LatestRevisionDate: 2012-08-07; Published: 2012-08-07; Value: Solderbridge; Note: N.A.; Artikkelnr Noca: N.A.; Footprint Doc: Solderbridge_Shorted; Part number IPS: N.A.; ComponentLink1URL: N.A.; ComponentLink1Description: Datasheet; ComponentLink2URL: N.A.; ComponentLink2Description: Supplier link; HelpURL: N.A.; Supplier 1: N.A.; Supplier Part Number 1: N.A.; Supplier 2: N.A.; Supplier Part Number 2: N.A.; Author: rsk; Component Class: Connectors; PartId: 100500459; Part number Norautron: N.A.
SB3 SB4 SB20-SB25 = Solderbridge: Manufacturer: N.A.; Part number NEMS: 100500458; Pad Count: 2; Component Status: Active; System: Connector; Part Number: Solderbridge; Manufacturer Part Number: N.A.; LatestRevisionDate: 2009-12-14; Published: 2009-12-14; Value: Solderbridge; Note: N.A.; Artikkelnr Noca: N.A.; Footprint Doc: Solderbridge; Part number IPS: N.A.; ComponentLink1URL: N.A.; ComponentLink1Description: Datasheet; ComponentLink2URL: N.A.; ComponentLink2Description: Supplier link; HelpURL: N.A.; Supplier 1: N.A.; Supplier Part Number 1: N.A.; Supplier 2: N.A.; Supplier Part Number 2: N.A.; Author: rsk; Component Class: Connectors; PartId: 100500458; Part number Norautron: N.A.
U1 = nRF52840-QIAAF0: Multi-protocol Bluetooth Low Energy, IEEE 802.15.4, ANT and 2.4GHz proprietary system-on-chip; Manufacturer: Nordic Semiconductor; Part number IPS: 80000002377; Part number NEMS: 102000222; Note: N.A.; Pad Count: 73; Component Status: Active; Part Number: nRF52840-QIAAF0; Manufacturer Part Number: nRF52840-QIAAF0; LatestRevisionDate: 2021-03-24; Published: 2021-03-24; Value: nRF52840-QIAA; Artikkelnr Noca: N.A.; Footprint Doc: AQFN-73; ComponentLink1URL: N.A.; ComponentLink1Description: Datasheet; ComponentLink2URL: N.A.; ComponentLink2Description: Supplier link; HelpURL: N.A.; Supplier 1: Nordic Semiconductor; Supplier Part Number 1: nRF52840-QIAAF0; Supplier 2: N.A.; Supplier Part Number 2: N.A.; PartId: 102000222; Component Class: Nordic_Devices; Author: hany; Part number Norautron: N.A.
X1 = XTAL_SMD2016_32MHz_8pF_Golledge_MP12308: XTAL SMD 2016, 32MHz, Cl=8pF, Tol: ±10ppm, Stab: ±15ppm, -30°C ~ 85°C, ESR: 50ohm max; Part number NEMS: 101600118,101600041; Note: XTAL SMD 32.000MHz; Artikkelnr Noca: N.A.; Pad Count: 4; Component Status: Active; Part Number: XTAL_SMD2016_32MHz_8pF_Golledge_MP12308; LatestRevisionDate: 2024-04-26; Published: 2024-04-26; Value: 32MHz; Footprint Doc: XTAL_2016; Manufacturer: Golledge; Manufacturer Part Number: MP12308; Part number IPS: N.A.; ComponentLink1URL: \\hizz\pro\app9717\Datasheet\crystals\Golledge\mp12308.pdf; ComponentLink1Description: Datasheet; ComponentLink2URL: N.A.; ComponentLink2Description: Supplier link; HelpURL: N.A.; Supplier 1: Link Nordic; Supplier Part Number 1: N.A.; Supplier 2: N.A.; Supplier Part Number 2: N.A.; Author: rubr; Component Class: Oscillators; PartId: 101600118; Part number Norautron: N.A.
X2 = XTAL_SMD3215_32.768kHz_9pF_NDK: XTAL SMD 3215, 32.768kHz, 9pF, ±20ppm; Manufacturer: NDK; Manufacturer Part Number: NX3215SA-32.768K-STD-MUA-9; Part number IPS: 00000005419; Part number Norautron: N.A.; Part number NEMS: 101600019; Note: XTAL SMD 32.768kHz; Artikkelnr Noca: 22010049; Pad Count: 2; Component Status: Active; Part Number: XTAL_SMD3215_32.768kHz_9pF_NDK; LatestRevisionDate: 2017-10-23; Published: 2017-10-23; Value: 32.768kHz; Footprint Doc: XTAL_3215; ComponentLink1URL: N.A.; ComponentLink1Description: Datasheet; ComponentLink2URL: N.A.; ComponentLink2Description: Supplier link; HelpURL: N.A.; Supplier 1: N.A.; Supplier Part Number 1: N.A.; Supplier 2: N.A.; Supplier Part Number 2: N.A.; Author: rsk; Component Class: Oscillators; PartId: 101600019

## Sheet pca10056_sheet3_interface_mcu.SchDoc: =BoardTitle+ ' - Interface MCU'
size A3; Organization: Nordic Semiconductor; DocumentNumber: 3; Revision: 3.0.3; SheetNumber: 3; SheetTotal: 6; Author: MASI/RUBR/STL1/RSK; CompanyName: Nordic Semiconductor; DrawnBy: MASI/RUBR/STL1/RSK; DocumentSize: A3; ProjectName: nRF52840-DK
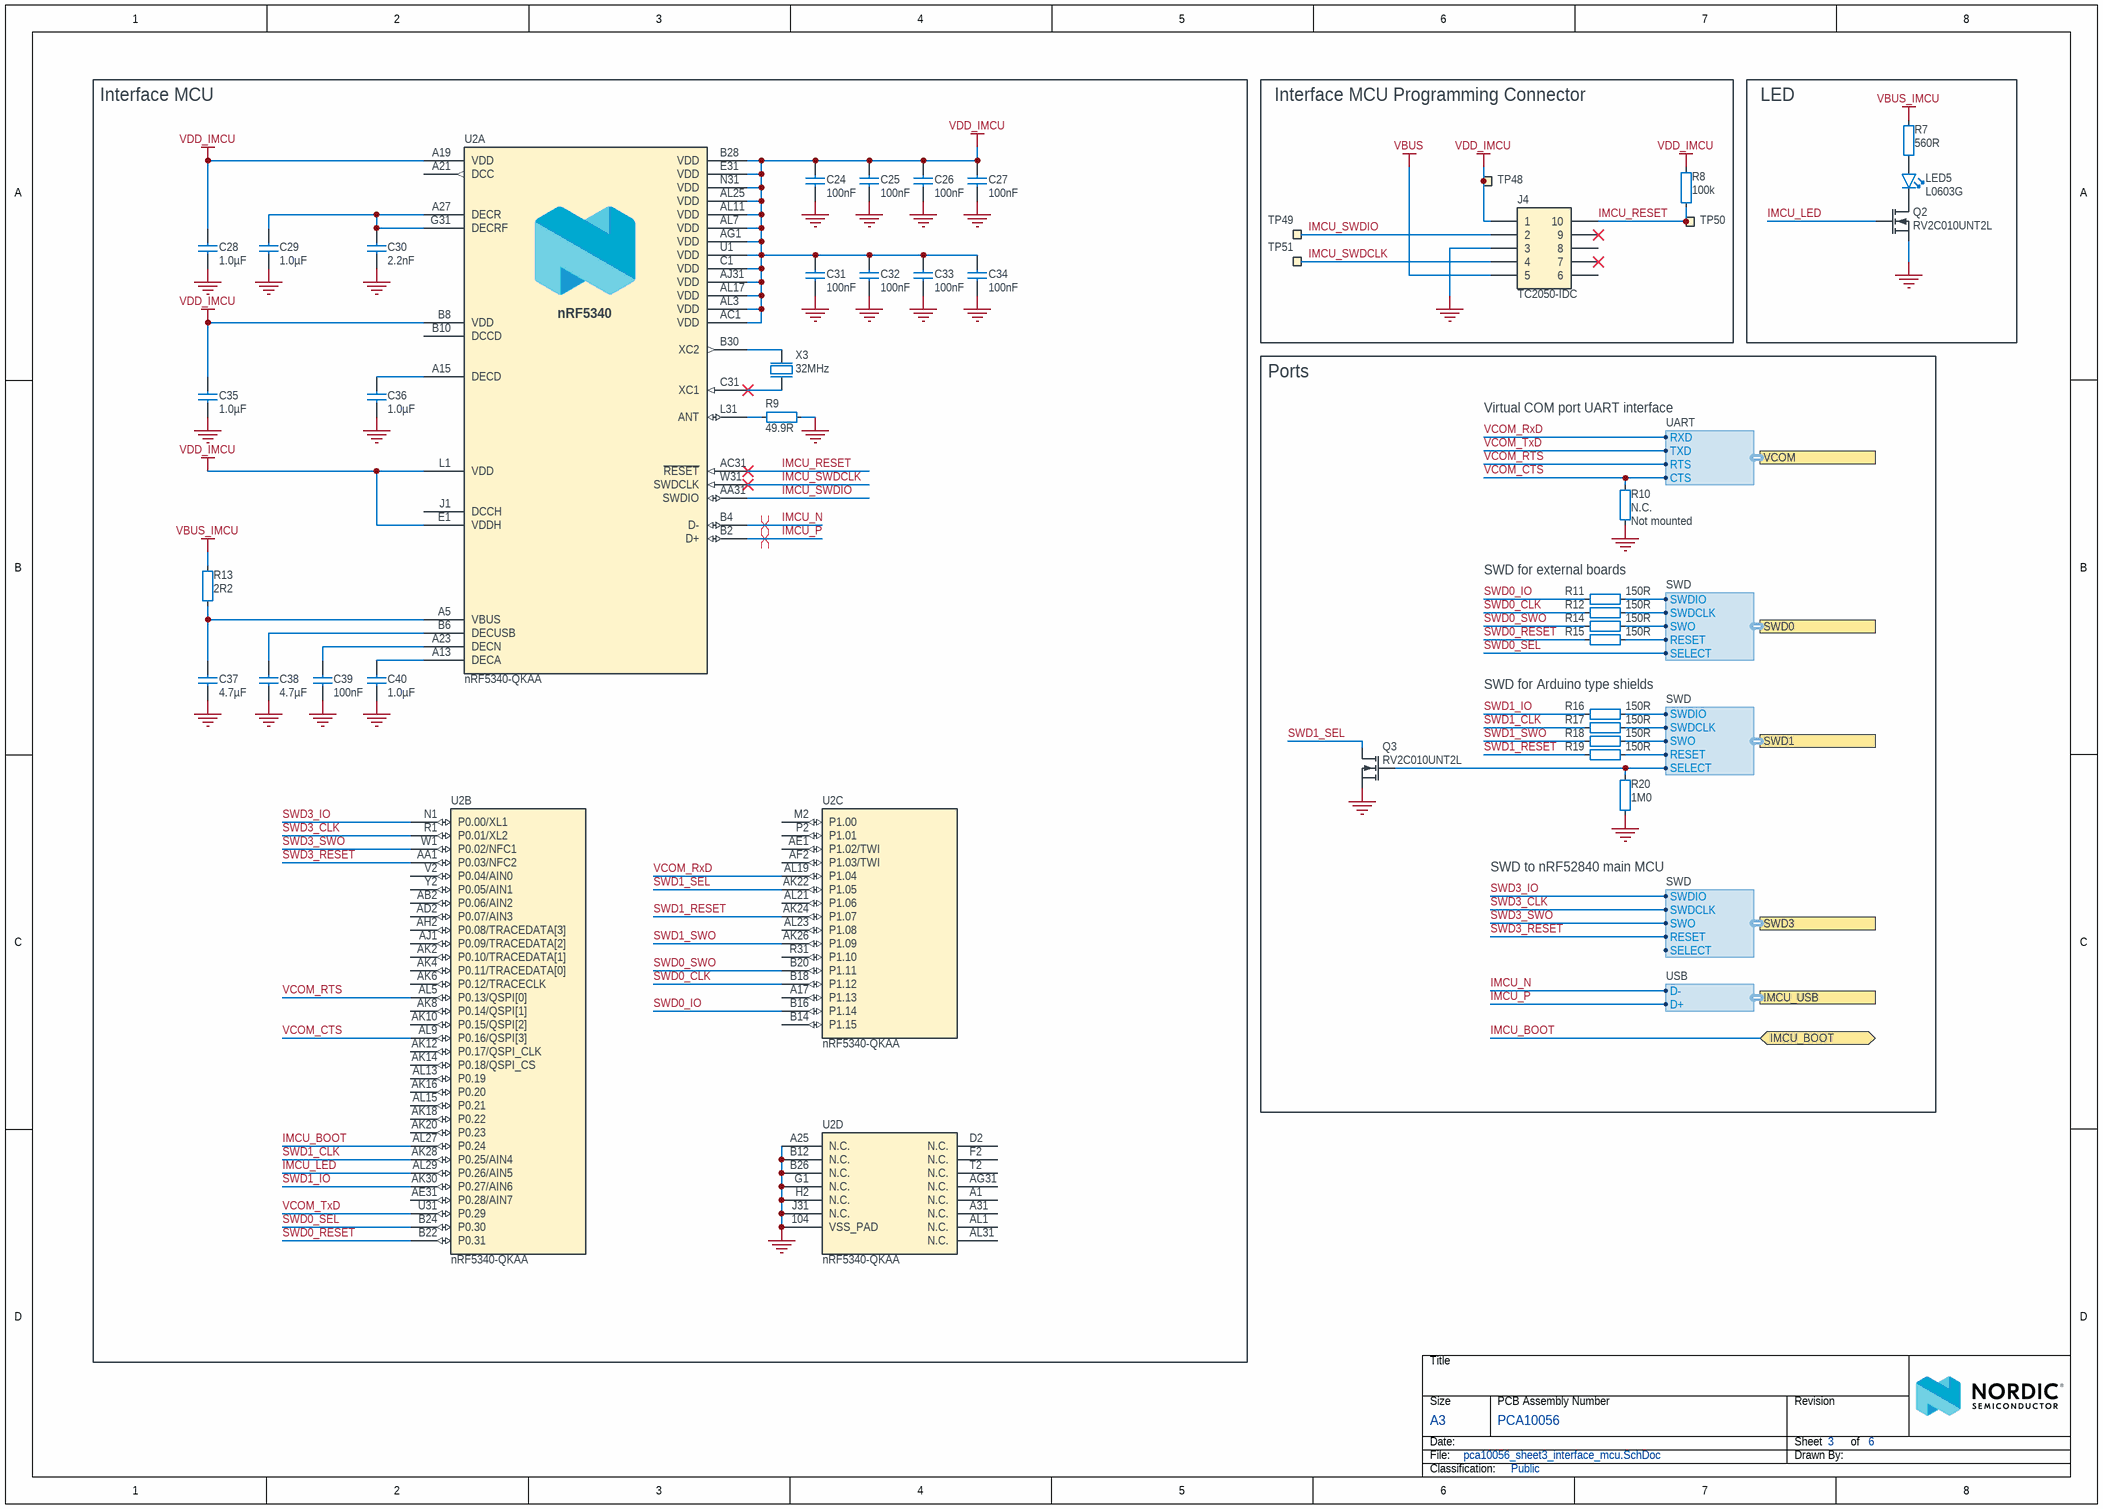
[diagram p2: pca10056_sheet3_interface_mcu.SchDoc]

### Parts
C24  100nF  [CAPC0603X03L_C]
C25  100nF  [CAPC0603X03L_C]
C26  100nF  [CAPC0603X03L_C]
C27  100nF  [CAPC0603X03L_C]
C28  1.0µF  [CAPC1005X04L]
C29  1.0µF  [CAPC1005X04L]
C30  2.2nF  [CAPC0603X03L_C]
C31  100nF  [CAPC0603X03L_C]
C32  100nF  [CAPC0603X03L_C]
C33  100nF  [CAPC0603X03L_C]
C34  100nF  [CAPC0603X03L_C]
C35  1.0µF  [CAPC1005X04L]
C36  1.0µF  [CAPC1005X04L]
C37  4.7µF  [CAPC1608X06L]
C38  4.7µF  [CAPC1608X06L]
C39  100nF  [CAPC0603X03L_C]
C40  1.0µF  [CAPC1005X04L]
J4  TC2050-IDC  [TC2050-IDC-NLFP]  (no BOM)
LED5  L0603G  [LED_0603_G]
Q2  RV2C010UNT2L  [DFN65P100X40-3L]
Q3  RV2C010UNT2L  [DFN65P100X40-3L]
R7  560R  [RESC0603X03L_C]
R8  100k  [RESC0603X03L_C]
R9  49.9R  [RESC0603X03L_C]
R10  N.C.  Assembly: Not mounted  [RESC0603X03L_C_NC]
R11  150R  [RESC0603X03L_C]
R12  150R  [RESC0603X03L_C]
R13  2R2  [RESC0603X03L_C]
R14  150R  [RESC0603X03L_C]
R15  150R  [RESC0603X03L_C]
R16  150R  [RESC0603X03L_C]
R17  150R  [RESC0603X03L_C]
R18  150R  [RESC0603X03L_C]
R19  150R  [RESC0603X03L_C]
R20  1M0  [RESC0603X03L_C]
TP48  Ø1.5mm,SMD  [TP_SMD_D1.5mm]  (value not drawn)  (no BOM)
TP49  Ø1.5mm,SMD  [TP_SMD_D1.5mm]  (value not drawn)  (no BOM)
TP50  Ø1.5mm,SMD  [TP_SMD_D1.5mm]  (value not drawn)  (no BOM)
TP51  Ø1.5mm,SMD  [TP_SMD_D1.5mm]  (value not drawn)  (no BOM)
U2  nRF5340-QKAA  [AQFN40P700X700X85_HS-99N]  (parts A,B,C,D of 4)
X3  32MHz  [BT-XTAL_2016]

### Blocks framed on the sheet
Interface MCU: C24-C40 R9 R13 U2 X3
Interface MCU Programming Connector: J4 R8 TP48-TP51
LED: LED5 Q2 R7
Ports: Q3 R10-R12 R14-R20

### Ports
IMCU_BOOT (bidir), IMCU_USB (harness USB), SWD0 (harness SWD), SWD1 (harness SWD), SWD3 (harness SWD), VCOM (harness UART)

### Harnesses
UART: RTS, CTS, RXD, TXD
SWD: SWDIO, SWDCLK, SWO, RESET, SELECT
USB: D+, D-

### Nets
GND: C24.2 C25.2 C26.2 C27.2 C28.2 C29.1 C30.2 C31.2 C32.2 C33.2 C34.2 C35.1 C36.1 C37.2 C38.2 C39.2 C40.1 J4.3 Q2.2(S) Q3.2(S) R9.2 R10.2 R20.2 U2.104(VSS_PAD) U2.A25(N.C.) U2.B12(N.C.) U2.B26(N.C.) U2.G1(N.C.) U2.H2(N.C.) U2.J31(N.C.) X3.2(GND) X3.4(GND)
VBUS: J4.5
VBUS_IMCU: R7.2 R13.1
VDD_IMCU: C24.1 C25.1 C26.1 C27.1 C28.1 C31.1 C32.1 C33.1 C34.1 C35.2 J4.1 R8.2 TP48.1 U2.A19(VDD) U2.AC1(VDD) U2.AG1(VDD) U2.AJ31(VDD) U2.AL3(VDD) U2.AL7(VDD) U2.AL11(VDD) U2.AL17(VDD) U2.AL25(VDD) U2.B8(VDD) U2.B28(VDD) U2.C1(VDD) U2.E1(VDDH) U2.E31(VDD) U2.L1(VDD) U2.N31(VDD) U2.U1(VDD)
IMCU_BOOT: U2.AL27(P0.24) ; port IMCU_BOOT
IMCU_LED: Q2.1(G) U2.AL29(P0.26/AIN5)
IMCU_N: U2.B4(D-) ; port IMCU_USB.D-
IMCU_P: U2.B2(D+) ; port IMCU_USB.D+
IMCU_RESET: J4.10 R8.1 TP50.1 U2.AC31(~{RESET})
IMCU_SWDCLK: J4.4 TP51.1 U2.W31(SWDCLK)
IMCU_SWDIO: J4.2 TP49.1 U2.AA31(SWDIO)
SWD0_CLK: R12.1 U2.B18(P1.12)
SWD0_IO: R11.1 U2.B16(P1.14)
SWD0_RESET: R15.1 U2.B22(P0.31)
SWD0_SEL: U2.B24(P0.30) ; port SWD0.SELECT
SWD0_SWO: R14.1 U2.B20(P1.11)
SWD1_CLK: R17.1 U2.AK28(P0.25/AIN4)
SWD1_IO: R16.1 U2.AK30(P0.27/AIN6)
SWD1_RESET: R19.1 U2.AK24(P1.07)
SWD1_SEL: Q3.3(D) U2.AK22(P1.05)
SWD1_SWO: R18.1 U2.AK26(P1.09)
SWD3_CLK: U2.R1(P0.01/XL2) ; port SWD3.SWDCLK
SWD3_IO: U2.N1(P0.00/XL1) ; port SWD3.SWDIO
SWD3_RESET: U2.AA1(P0.03/NFC2) ; port SWD3.RESET
SWD3_SWO: U2.W1(P0.02/NFC1) ; port SWD3.SWO
VCOM_CTS: R10.1 U2.AL9(P0.16/QSPI[3]) ; port VCOM.CTS
VCOM_RTS: U2.AL5(P0.13/QSPI[0]) ; port VCOM.RTS
VCOM_RxD: U2.AL19(P1.04) ; port VCOM.RXD
VCOM_TxD: U2.U31(P0.29) ; port VCOM.TXD
NetC29_2: C29.2 C30.1 U2.A27(DECR) U2.G31(DECRF)
NetC36_2: C36.2 U2.A15(DECD)
NetC37_1: C37.1 R13.2 U2.A5(VBUS)
NetC38_1: C38.1 U2.B6(DECUSB)
NetC39_1: C39.1 U2.A23(DECN)
NetC40_2: C40.2 U2.A13(DECA)
NetLED5_1: LED5.1(C) Q2.3(D)
NetLED5_2: LED5.2(A) R7.1
NetP19_2: R11.2 ; port SWD0.SWDIO
NetP19_4: R12.2 ; port SWD0.SWDCLK
NetP19_6: R14.2 ; port SWD0.SWO
NetP19_10: R15.2 ; port SWD0.RESET
NetP20_3: Q3.1(G) R20.1 ; port SWD1.SELECT
NetP20_4: R16.2 ; port SWD1.SWDIO
NetP20_5: R17.2 ; port SWD1.SWDCLK
NetP20_6: R18.2 ; port SWD1.SWO
NetP20_7: R19.2 ; port SWD1.RESET
NetR9_1: R9.1 U2.L31(ANT)
NetU2_B30: U2.B30(XC2) X3.3(out)
NetU2_C31: U2.C31(XC1) X3.1(inp)

Not connected (* = marked no-connect by the designer): J4 6 7* 8 9*; U2 A1(N.C.) A17(P1.13) A21(DCC) A31(N.C.) AB2(P0.06/AIN2) AD2(P0.07/AIN3) AE1(P1.02/TWI) AE31(P0.28/AIN7) AF2(P1.03/TWI) AG31(N.C.) AH2(P0.08/TRACEDATA[3]) AJ1(P0.09/TRACEDATA[2]) AK2(P0.10/TRACEDATA[1]) AK4(P0.11/TRACEDATA[0]) AK6(P0.12/TRACECLK) AK8(P0.14/QSPI[1]) AK10(P0.15/QSPI[2]) AK12(P0.17/QSPI_CLK) AK14(P0.18/QSPI_CS) AK16(P0.20) AK18(P0.22) AK20(P0.23) AL1(N.C.) AL13(P0.19) AL15(P0.21) AL21(P1.06) AL23(P1.08) AL31(N.C.) B10(DCCD) B14(P1.15) D2(N.C.) F2(N.C.) J1(DCCH) M2(P1.00) P2(P1.01) R31(P1.10) T2(N.C.) V2(P0.04/AIN0) Y2(P0.05/AIN1)

### Layout directives
differential pair: IMCU_N, IMCU_P

### Notes on the sheet
- Virtual COM port UART interface
- SWD for external boards
- SWD for Arduino type shields
- (near R20) SWD to nRF52840 main MCU
- Title
- Size
- Date:
- File:
- A3
- PCB Assembly Number
- Sheet         of
- Drawn By:
- Revision
- Classification:
- (in symbol nRF5340-QKAAD0, part A) nRF5340

### Library data of the parts
C24-C27 C31-C34 C39 = C0201-100n: Capacitor, X5R, ±10%; Manufacturer: N.A.; Part number IPS: 00000001248, 00000002505; Part number Norautron: 262071862; Part number NEMS: 100200078; Pad Count: 2; Note: 16V; Component Status: Active; Part Number: C0201-100n; Value: 100nF; Footprint Doc: 0201; Component Class: Capacitors; Author: rsk; PartId: 100200078; Manufacturer Part Number: N.A.; ComponentLink1URL: N.A.; ComponentLink1Description: Datasheet; ComponentLink2URL: N.A.; ComponentLink2Description: Supplier link; HelpURL: N.A.; LatestRevisionDate: 2017-11-09; Published: 2014-11-13; Supplier 1: N.A.; Supplier Part Number 1: N.A.; Supplier 2: N.A.; Supplier Part Number 2: N.A.; Artikkelnr Noca: N.A.
C28 C29 C35 C36 C40 = C0402-1µ0-6.3V-X5R-10%: Capacitor, X5R, ±10%, 6.3V; Manufacturer: N.A.; Part number Norautron: 26207137; Part number NEMS: 100200498; Pad Count: 2; Component Status: Active; Part Number: C0402-1µ0-6.3V-X5R-10%; PartId: 100200498; Component Class: Capacitors; Author: rubr; Manufacturer Part Number: N.A.; ComponentLink1URL: N.A.; ComponentLink1Description: Datasheet; ComponentLink2URL: N.A.; ComponentLink2Description: Supplier link; HelpURL: N.A.; Footprint Doc: 0402; LatestRevisionDate: 2022-01-27; Published: 2022-01-27; Value: 1.0µF; Note: 6.3V; Supplier 1: N.A.; Supplier Part Number 1: N.A.; Supplier 2: N.A.; Supplier Part Number 2: N.A.; Artikkelnr Noca: N.A.; Part number IPS: N.A.
C30 = C0201-2n2: Capacitor, X7R, ±10%, 10V; Manufacturer: N.A.; Part number IPS: 00000001778; Part number Norautron: 26470002; Part number NEMS: 100200060; Pad Count: 2; Component Status: Active; Part Number: C0201-2n2; Value: 2.2nF; Footprint Doc: 0201; Component Class: Capacitors; Author: rsk; PartId: 100200060; Manufacturer Part Number: N.A.; ComponentLink1URL: N.A.; ComponentLink1Description: Datasheet; ComponentLink2URL: N.A.; ComponentLink2Description: Supplier link; HelpURL: N.A.; LatestRevisionDate: 2014-11-13; Published: 2014-11-13; Note: 10V; Supplier 1: N.A.; Supplier Part Number 1: N.A.; Supplier 2: N.A.; Supplier Part Number 2: N.A.; Artikkelnr Noca: N.A.
C37 = C0603-4µ7-10V-X7S: Capacitor, X7S, ±10%, 10V; Manufacturer: N.A.; Part number IPS: 00000001779; Part number NEMS: 100200351; Pad Count: 2; Artikkelnr Noca: 20030013; Component Status: Active; Part Number: C0603-4µ7-10V-X7S; Value: 4.7µF; Footprint Doc: 0603; Component Class: Capacitors; Author: rsk; PartId: 100200351; Manufacturer Part Number: N.A.; ComponentLink1URL: N.A.; ComponentLink1Description: Datasheet; ComponentLink2URL: N.A.; ComponentLink2Description: Supplier link; HelpURL: N.A.; LatestRevisionDate: 2016-08-15; Published: 2016-08-15; Note: 10V; Supplier 1: Digi-Key; Supplier Part Number 1: 445-14258-1-ND; Supplier 2: N.A.; Supplier Part Number 2: N.A.; Part number Norautron: N.A.
C38 = C0603-4µ7-6.3V-X7R: Capacitor, X7R, ±10%, 6.3V; Manufacturer: Samsung Electro-Mechanics America; Manufacturer Part Number: CL10B475KQ8NQNC; Part number IPS: 00000002541; Part number Norautron: N.A.; Part number NEMS: 100200350; Pad Count: 2; Artikkelnr Noca: 20039473; Component Status: Active; Part Number: C0603-4µ7-6.3V-X7R; Value: 4.7µF; Footprint Doc: 0603; Component Class: Capacitors; Author: rsk; PartId: 100200350; ComponentLink1URL: N.A.; ComponentLink1Description: Datasheet; ComponentLink2URL: N.A.; ComponentLink2Description: Supplier link; HelpURL: http://media.digikey.com/pdf/Data%20Sheets/Samsung%20PDFs/CL10B475KQ8NQNC_Spec.pdf; LatestRevisionDate: 2015-06-10; Published: 2015-06-10; Note: 6.3V; Supplier 1: Digi-Key; Supplier Part Number 1: 1276-2087-1-ND; Supplier 2: N.A.; Supplier Part Number 2: N.A.
J4 = TC2050-IDC-NLFP: CBL PLUG-OF-NAILS 10-PIN; Manufacturer: Tag-Connect LLC; Part number NEMS: 100500463; Artikkelnr Noca: N.A.; Pad Count: 10; Component Status: Active; System: Connector; Part Number: TC2050-IDC-NLFP; Manufacturer Part Number: TC2050-IDC-NLFP; LatestRevisionDate: 2012-11-21; Published: 2012-11-21; Value: TC2050-IDC; Footprint Doc: TC2050-IDC-NLFP; Part number IPS: N.A.; ComponentLink1URL: N.A.; ComponentLink1Description: Datasheet; ComponentLink2URL: N.A.; ComponentLink2Description: Supplier link; HelpURL: http://www.tag-connect.com/Materials/TC2050-IDC%20Datasheet.pdf; Supplier 1: Digi-Key; Supplier Part Number 1: TC2050-IDC-NL-ND; Supplier 2: N.A.; Supplier Part Number 2: N.A.; Component Class: Connectors; Note: N.A.; PartId: 100500463; Author: rsk; Part number Norautron: N.A.
LED5 = VS 25C7M5: LED, Green, 0603, 573nm, Vf=2.0V, 24mcd, - 40 to +85°C; Manufacturer: Victory Electronics; Part number IPS: 00000001274, 00000009961; Part number Norautron: 26313411; Part number NEMS: 101400097; Note: N.A.; Artikkelnr Noca: 13019193; Pad Count: 2; Component Status: Active; Part Number: VS 25C7M5; Manufacturer Part Number: VS 25C7M5; Footprint Doc: 0603; LatestRevisionDate: 2020-10-23; Published: 2017-08-21; Value: L0603G; ComponentLink1URL: N.A.; ComponentLink1Description: Datasheet; ComponentLink2URL: N.A.; ComponentLink2Description: Supplier link; HelpURL: \\hizz\pro\app9717\Datasheet\optoelectronics\Victory Electronics\VS 25C7M5.pdf; Supplier 1: EC Partner; Supplier Part Number 1: N.A.; Supplier 2: N.A.; Supplier Part Number 2: N.A.; PartId: 101400097; Component Class: Optoelectronics; Author: rsk
Q2 Q3 = RV2C010UNT2L: N-Channel MOSFET, 20V, 1A, 470mOhm, 400mW; Manufacturer: Rohm Semiconductor; Part number IPS: 00000009976; Part number Norautron: 26320026; Part number NEMS: 101300132; Note: N.A.; Artikkelnr Noca: 35010020; Pad Count: 3; Component Status: Active; Part Number: RV2C010UNT2L; Manufacturer Part Number: RV2C010UNT2L; ComponentLink1URL: N.A.; ComponentLink1Description: Datasheet; ComponentLink2URL: N.A.; ComponentLink2Description: Supplier link; HelpURL: http://rohmfs.rohm.com/en/products/databook/datasheet/discrete/transistor/mosfet/rv2c010unt2l-e.pdf; Footprint Doc: DFN-3; LatestRevisionDate: 2016-08-09; Published: 2016-08-09; Value: RV2C010UNT2L; Supplier 1: Digi-Key; Supplier Part Number 1: RV2C010UNT2LCT-ND; Supplier 2: Mouser; Supplier Part Number 2: 755-RV2C010UNT2L; PartId: 101300132; Component Class: Semiconductors; Author: rsk
R7 = R0201-560: Resistor, ±1%, 0.05W; Manufacturer: N.A.; Part number NEMS: 100100038; Note: Chip Res 1%; Pad Count: 2; Component Status: Active; Part Number: R0201-560; Manufacturer Part Number: N.A.; ComponentLink1URL: N.A.; ComponentLink1Description: Datasheet; ComponentLink2URL: N.A.; ComponentLink2Description: Supplier link; HelpURL: N.A.; Footprint Doc: 0201; LatestRevisionDate: 2014-11-13; Published: 2014-11-13; Value: 560R; Supplier 1: N.A.; Supplier Part Number 1: N.A.; Supplier 2: N.A.; Supplier Part Number 2: N.A.; Artikkelnr Noca: N.A.; Part number IPS: N.A.; PartId: 100100038; Component Class: Resistors; Author: rsk; Part number Norautron: N.A.
R8 = R0201-100k: Resistor, ±1%, 0.05W; Manufacturer: N.A.; Part number IPS: 00000001419; Part number Norautron: 26108487; Part number NEMS: 100100080; Note: Chip Res 1%; Pad Count: 2; Component Status: Active; Part Number: R0201-100k; Manufacturer Part Number: N.A.; ComponentLink1URL: N.A.; ComponentLink1Description: Datasheet; ComponentLink2URL: N.A.; ComponentLink2Description: Supplier link; HelpURL: N.A.; Footprint Doc: 0201; LatestRevisionDate: 2014-11-13; Published: 2014-11-13; Value: 100k; Artikkelnr Noca: N.A.; Supplier 1: N.A.; Supplier Part Number 1: N.A.; Supplier 2: N.A.; Supplier Part Number 2: N.A.; Component Class: Resistors; PartId: 100100080; Author: rsk
R9 = R0201-49R9: Resistor, ±1%, 0.05W; Manufacturer: N.A.; Part number Norautron: 26107071; Part number NEMS: 100100612; Pad Count: 2; Note: Chip Res 1%; Component Status: Active; Part Number: R0201-49R9; PartId: 100100612; Component Class: Resistors; Author: getr; Manufacturer Part Number: N.A.; ComponentLink1URL: N.A.; ComponentLink1Description: Datasheet; ComponentLink2URL: N.A.; ComponentLink2Description: Supplier link; HelpURL: N.A.; Footprint Doc: 0201; LatestRevisionDate: 2021-04-15; Published: 2021-04-15; Value: 49.9R; Supplier 1: N.A.; Supplier Part Number 1: N.A.; Supplier 2: N.A.; Supplier Part Number 2: N.A.; Artikkelnr Noca: N.A.; Part number IPS: N.A.
R10 = R0201-N.C.: Not mounted; Manufacturer: N.A.; Part number NEMS: 100100107; Note: Chip Res; Pad Count: 2; Component Status: Active; Part Number: R0201-N.C.; Manufacturer Part Number: N.A.; ComponentLink1URL: N.A.; ComponentLink1Description: Datasheet; ComponentLink2URL: N.A.; ComponentLink2Description: Supplier link; HelpURL: N.A.; Footprint Doc: 0201; LatestRevisionDate: 2014-11-13; Published: 2014-11-13; Value: N.C.; Supplier 1: N.A.; Supplier Part Number 1: N.A.; Supplier 2: N.A.; Supplier Part Number 2: N.A.; Artikkelnr Noca: N.A.; Part number IPS: N.A.; PartId: 100100107; Component Class: Resistors; Author: rsk; Part number Norautron: N.A.
R11 R12 R14-R19 = R0201-150: Resistor, ±1%, 0.05W; Manufacturer: N.A.; Part number IPS: 00000001420; Part number NEMS: 100100029; Note: Chip Res 1%; Pad Count: 2; Component Status: Active; Part Number: R0201-150; Manufacturer Part Number: N.A.; ComponentLink1URL: N.A.; ComponentLink1Description: Datasheet; ComponentLink2URL: N.A.; ComponentLink2Description: Supplier link; HelpURL: N.A.; Footprint Doc: 0201; LatestRevisionDate: 2014-11-13; Published: 2014-11-13; Value: 150R; Artikkelnr Noca: N.A.; Supplier 1: N.A.; Supplier Part Number 1: N.A.; Supplier 2: N.A.; Supplier Part Number 2: N.A.; PartId: 100100029; Component Class: Resistors; Author: rsk; Part number Norautron: N.A.
R13 = R0201-2R2: Resistor, ±1%, 0.05W; Manufacturer: N.A.; Part number Norautron: 26470029; Part number NEMS: 100100006; Pad Count: 2; Note: Chip Res 1%; Component Status: Active; Part Number: R0201-2R2; Footprint Doc: 0201; Value: 2R2; Component Class: Resistors; Author: rsk; PartId: 100100006; Manufacturer Part Number: N.A.; ComponentLink1URL: N.A.; ComponentLink1Description: Datasheet; ComponentLink2URL: N.A.; ComponentLink2Description: Supplier link; HelpURL: N.A.; LatestRevisionDate: 2014-11-13; Published: 2014-11-13; Supplier 1: N.A.; Supplier Part Number 1: N.A.; Supplier 2: N.A.; Supplier Part Number 2: N.A.; Artikkelnr Noca: N.A.; Part number IPS: N.A.
R20 = R0201-1M0: Resistor, ±1%, 0.05W; Manufacturer: N.A.; Part number IPS: 00000001418; Part number Norautron: 26107108; Part number NEMS: 100100093; Note: Chip Res 1%; Pad Count: 2; Component Status: Active; Part Number: R0201-1M0; Manufacturer Part Number: N.A.; ComponentLink1URL: N.A.; ComponentLink1Description: Datasheet; ComponentLink2URL: N.A.; ComponentLink2Description: Supplier link; HelpURL: N.A.; Footprint Doc: 0201; LatestRevisionDate: 2014-11-13; Published: 2014-11-13; Value: 1M0; Supplier 1: N.A.; Supplier Part Number 1: N.A.; Supplier 2: N.A.; Supplier Part Number 2: N.A.; Artikkelnr Noca: N.A.; PartId: 100100093; Component Class: Resistors; Author: rsk
TP48-TP51 = TP_SMD_Ø1.5MM: 1.5mm circular SMD testpad; Manufacturer: Nordic Semiconductor; Manufacturer Part Number: N.A.; Part number NEMS: 100500477; Pad Count: 1; Component Status: Active; Part Number: TP_SMD_Ø1.5MM; ComponentLink1URL: N.A.; ComponentLink1Description: Datasheet; ComponentLink2URL: N.A.; ComponentLink2Description: Supplier link; HelpURL: N.A.; Footprint Doc: TP_SMD_Ø1.5mm; LatestRevisionDate: 2021-03-05; Published: 2016-06-02; Value: Ø1.5mm,SMD; Note: N.A.; Artikkelnr Noca: N.A.; Part number IPS: N.A.; Supplier 1: N.A.; Supplier Part Number 1: N.A.; Supplier 2: N.A.; Supplier Part Number 2: N.A.; Component Class: Connectors; PartId: 100500477; Author: rsk; Part number Norautron: N.A.
U2 = nRF5340-QKAAD0: Multi-protocol Bluetooth Low Energy, IEEE 802.15.4, ANT and 2.4GHz proprietary system-on-chip; Manufacturer: Nordic Semiconductor; Part number Norautron: NOD26470035; Part number NEMS: 102000216; Pad Count: 98; Note: N.A.; Component Status: Active; Part Number: nRF5340-QKAAD0; Footprint Doc: AQFN-98; Value: nRF5340-QKAA; Component Class: Nordic_Devices; Author: rsk; PartId: 102000216; Manufacturer Part Number: nRF5340-QKAAD0; ComponentLink1URL: N.A.; ComponentLink1Description: Datasheet; ComponentLink2URL: N.A.; ComponentLink2Description: Supplier link; HelpURL: N.A.; LatestRevisionDate: 2020-12-02; Published: 2020-12-02; Supplier 1: Nordic Semiconductor; Supplier Part Number 1: nRF5340-QKAAD0; Supplier 2: N.A.; Supplier Part Number 2: N.A.; Artikkelnr Noca: N.A.; Part number IPS: N.A.
X3 = XTAL_SMD2016_32MHz_8pF_Golledge_MP12308: as X1 on sheet pca10056_sheet2_nrf52840_mcu; Part Number: XTAL_SMD2016_32MHz_8pF_Golledge_MP12308; Manufacturer: Golledge; Manufacturer Part Number: MP12308; LatestRevisionDate: 2024-04-26; Published: 2024-04-26; Value: 32MHz; Footprint Doc: XTAL_2016; Part number IPS: N.A.; ComponentLink1URL: \\hizz\pro\app9717\Datasheet\crystals\Golledge\mp12308.pdf; ComponentLink1Description: Datasheet; ComponentLink2URL: N.A.; ComponentLink2Description: Supplier link; HelpURL: N.A.; Supplier 1: Link Nordic; Supplier Part Number 1: N.A.; Supplier 2: N.A.; Supplier Part Number 2: N.A.; PartId: 101600118; Component Class: Oscillators; Author: rubr; Part number Norautron: N.A.